# EAGLE design schema_v2_1 (EAGLE 6.2)
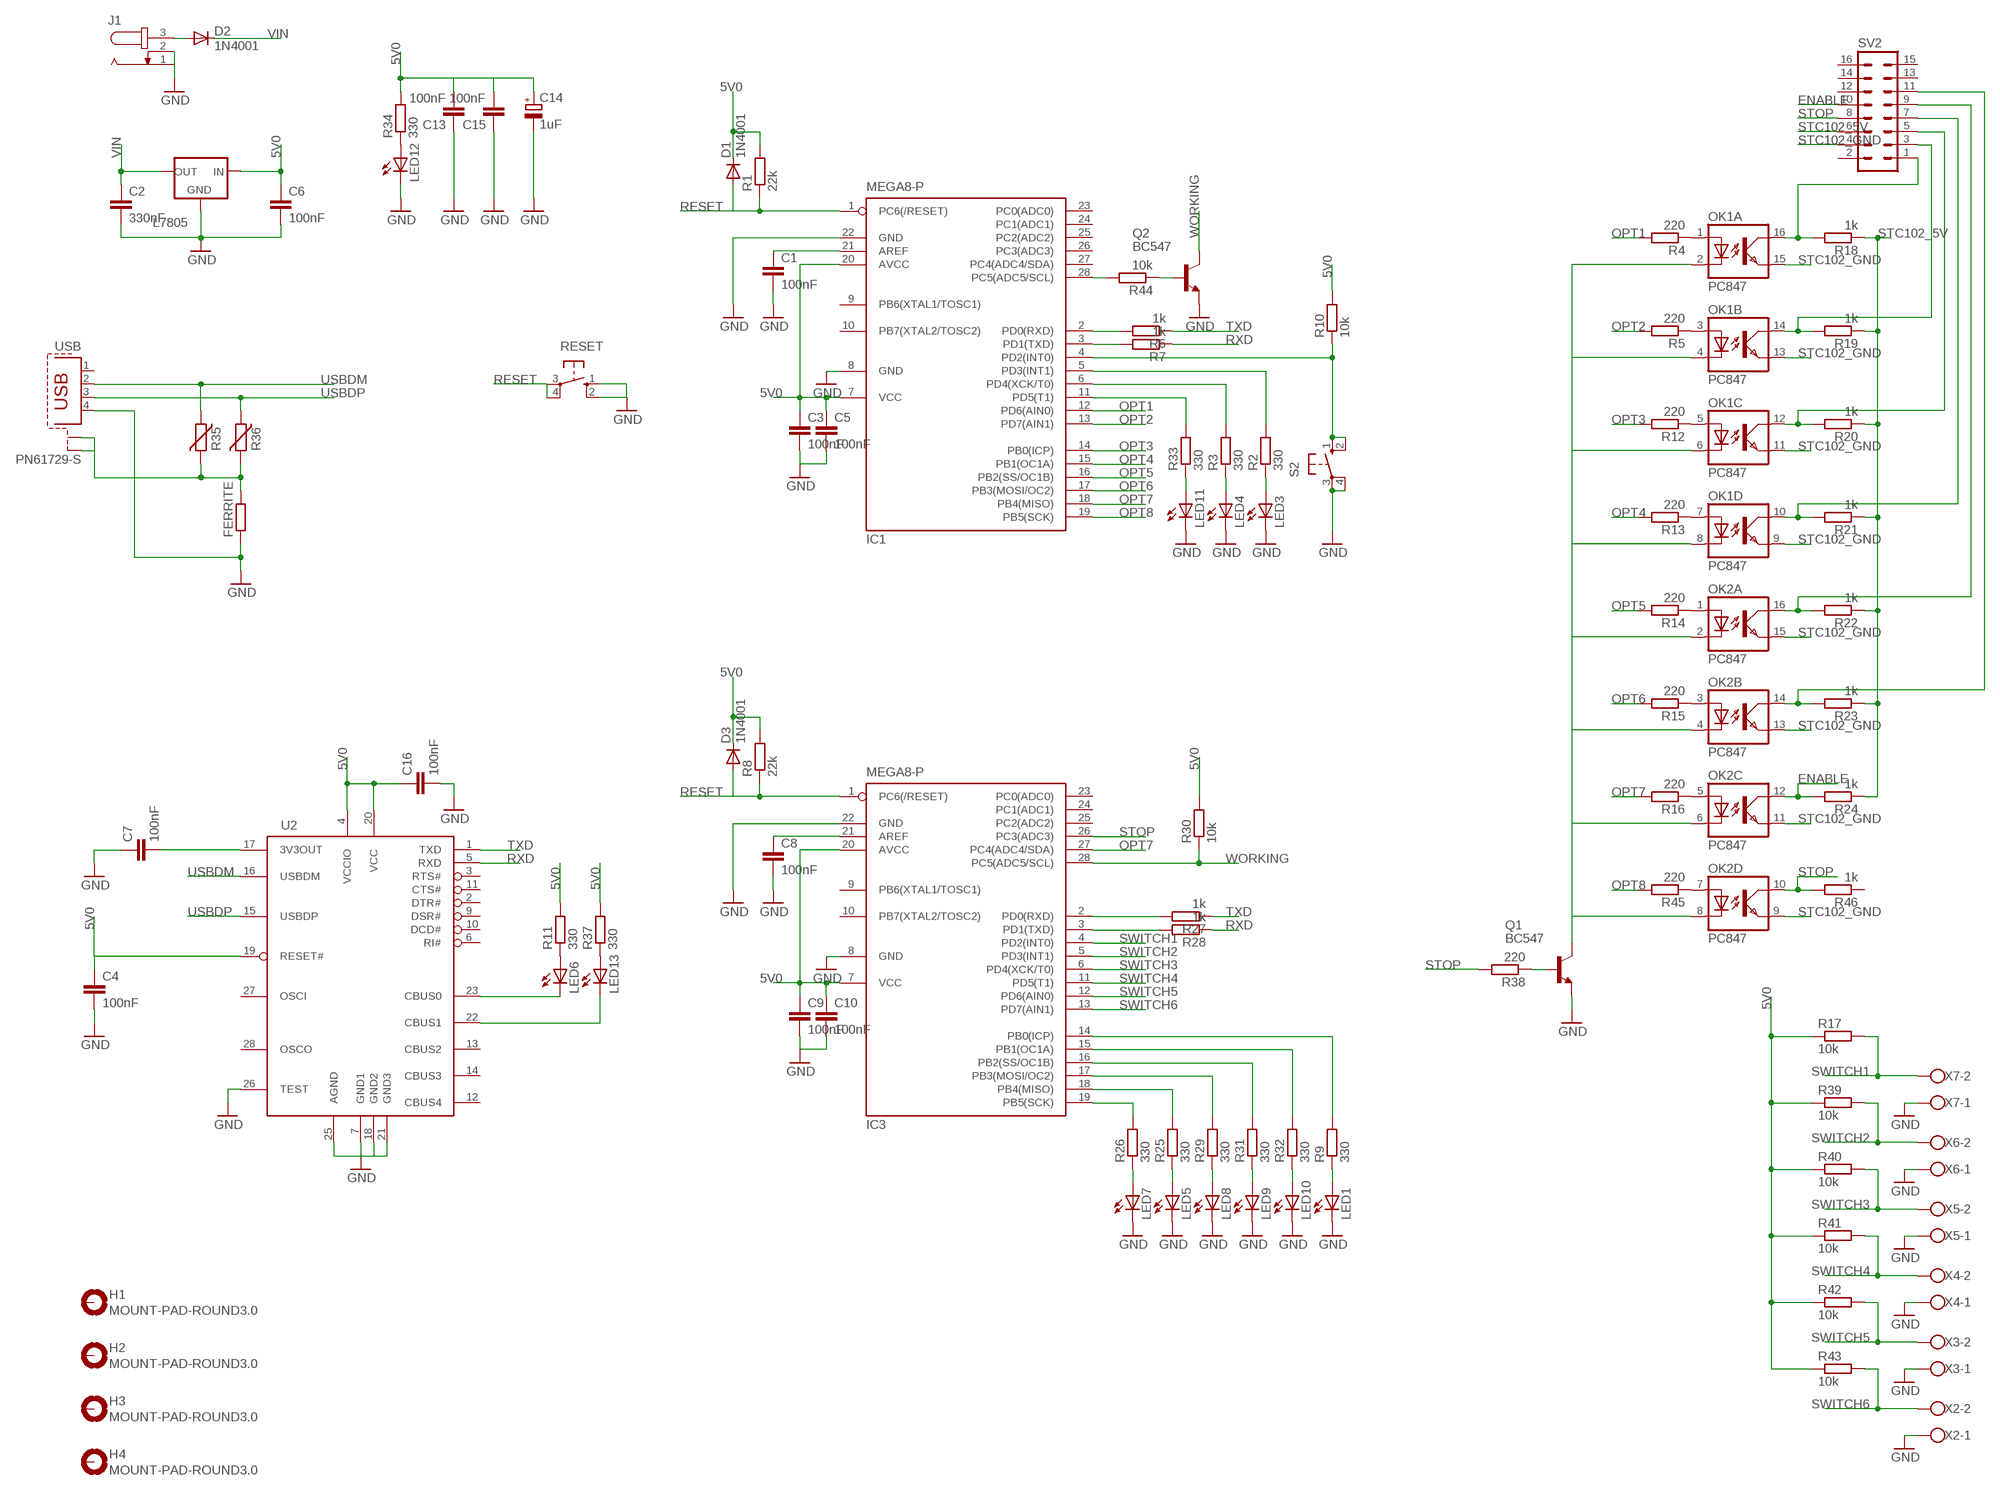
[diagram p0: schematic, sheet 1]

## Parts
C1  100nF  C-EU025-025X050  [C025-025X050]
C2  330nF  C-EU025-025X050  [C025-025X050]
C3  100nF  C-EU025-025X050  [C025-025X050]
C4  100nF  C-EUC0603K  [C0603K]
C5  100nF  C-EU025-025X050  [C025-025X050]
C6  100nF  C-EU025-025X050  [C025-025X050]
C7  100nF  C-EUC0603K  [C0603K]
C8  100nF  C-EU025-025X050  [C025-025X050]
C9  100nF  C-EU025-025X050  [C025-025X050]
C10  100nF  C-EU025-025X050  [C025-025X050]
C13  100nF  C-EU025-025X050  [C025-025X050]
C14  1uF  CPOL-EUE2.5-5  [E2,5-5]
C15  100nF  C-EU025-025X050  [C025-025X050]
C16  100nF  C-EUC0603K  [C0603K]
D1  1N4001  1N4004  [DO41-10]
D2  1N4001  1N4004  [DO41-10]
D3  1N4001  1N4004  [DO41-10]
FERRITE  R-EU_M0805  [M0805]
H1  MOUNT-PAD-ROUND3.0  [3,0-PAD]
H2  MOUNT-PAD-ROUND3.0  [3,0-PAD]
H3  MOUNT-PAD-ROUND3.0  [3,0-PAD]
H4  MOUNT-PAD-ROUND3.0  [3,0-PAD]
IC1  MEGA8-P  [DIL28-3]
IC3  MEGA8-P  [DIL28-3]
J1  JACK-PLUG0  [SPC4077]
L7805  79XXS  [79XXS]
LED1  LED3MM  [LED3MM]
LED3  LED3MM  [LED3MM]
LED4  LED3MM  [LED3MM]
LED5  LED3MM  [LED3MM]
LED6  LED3MM  [LED3MM]
LED7  LED3MM  [LED3MM]
LED8  LED3MM  [LED3MM]
LED9  LED3MM  [LED3MM]
LED10  LED3MM  [LED3MM]
LED11  LED3MM  [LED3MM]
LED12  LED3MM  [LED3MM]
LED13  LED3MM  [LED3MM]
OK1  PC847  [DIL16]
OK2  PC847  [DIL16]
Q1  BC547  [TO92]
Q2  BC547  [TO92]
R1  22k  R-EU_0207/10  [0207/10]
R2  330  R-EU_0207/10  [0207/10]
R3  330  R-EU_0207/10  [0207/10]
R4  220  R-EU_0207/10  [0207/10]
R5  220  R-EU_0207/10  [0207/10]
R6  1k  R-EU_M1206  [M1206]
R7  1k  R-EU_M1206  [M1206]
R8  22k  R-EU_0207/10  [0207/10]
R9  330  R-EU_0207/10  [0207/10]
R10  10k  R-EU_0207/10  [0207/10]
R11  330  R-EU_0207/10  [0207/10]
R12  220  R-EU_0207/10  [0207/10]
R13  220  R-EU_0207/10  [0207/10]
R14  220  R-EU_0207/10  [0207/10]
R15  220  R-EU_0207/10  [0207/10]
R16  220  R-EU_0207/10  [0207/10]
R17  10k  R-EU_R1206  [R1206]
R18  1k  R-EU_0207/10  [0207/10]
R19  1k  R-EU_0207/10  [0207/10]
R20  1k  R-EU_0207/10  [0207/10]
R21  1k  R-EU_0207/10  [0207/10]
R22  1k  R-EU_0207/10  [0207/10]
R23  1k  R-EU_0207/10  [0207/10]
R24  1k  R-EU_0207/10  [0207/10]
R25  330  R-EU_0207/10  [0207/10]
R26  330  R-EU_0207/10  [0207/10]
R27  1k  R-EU_M1206  [M1206]
R28  1k  R-EU_M1206  [M1206]
R29  330  R-EU_0207/10  [0207/10]
R30  10k  R-EU_0207/10  [0207/10]
R31  330  R-EU_0207/10  [0207/10]
R32  330  R-EU_0207/10  [0207/10]
R33  330  R-EU_0207/10  [0207/10]
R34  330  R-EU_0207/10  [0207/10]
R35  VARISTORCN0603  [CT/CN0603]
R36  VARISTORCN0603  [CT/CN0603]
R37  330  R-EU_0207/10  [0207/10]
R38  220  R-EU_0207/10  [0207/10]
R39  10k  R-EU_0207/10  [0207/10]
R40  10k  R-EU_0207/10  [0207/10]
R41  10k  R-EU_0207/10  [0207/10]
R42  10k  R-EU_0207/10  [0207/10]
R43  10k  R-EU_0207/10  [0207/10]
R44  10k  R-EU_0207/10  [0207/10]
R45  220  R-EU_0207/10  [0207/10]
R46  1k  R-EU_0207/10  [0207/10]
RESET  10-XX  [B3F-10XX]
S2  10-XX  [B3F-10XX]
SV2  MA08-2  [MA08-2]
U2  FT232RL  [SSOP28DB]
USB  PN61729-S  [PN61729-S]
X2  W237-102  [W237-102]
X3  W237-102  [W237-102]
X4  W237-102  [W237-102]
X5  W237-102  [W237-102]
X6  W237-102  [W237-102]
X7  W237-102  [W237-102]

## Nets
5V0: C3.1 C4.1 C5.1 C6.1 C9.1 C10.1 C13.2 C14.+ C15.2 C16.1 D1.C D3.C IC1.7(VCC) IC1.20(AVCC) IC3.7(VCC) IC3.20(AVCC) L7805.IN R1.2 R8.2 R10.2 R11.2 R17.1 R30.2 R34.2 R37.2 R39.1 R40.1 R41.1 R42.1 R43.1 U2.4(VCCIO) U2.19(RESET#) U2.20(VCC)
ENABLE: OK2.12(C:COL) R24.2 SV2.10
GND: C1.2 C2.2 C3.2 C4.2 C5.2 C6.2 C7.1 C8.2 C9.2 C10.2 C13.1 C14.- C15.1 C16.2 FERRITE.1 IC1.8(GND) IC1.22(GND) IC3.8(GND) IC3.22(GND) J1.1 J1.2 L7805.GND LED1.K(C) LED3.K(C) LED4.K(C) LED5.K(C) LED7.K(C) LED8.K(C) LED9.K(C) LED10.K(C) LED11.K(C) LED12.K(C) Q1.1(E) Q2.1(E) RESET.1(S) RESET.2(S1) S2.3(P) S2.4(P1) U2.7(GND1) U2.18(GND2) U2.21(GND3) U2.25(AGND) U2.26(TEST) USB.4 X2.1 X3.1 X4.1 X5.1 X6.1 X7.1
N$1: IC1.28(PC5(ADC5/SCL)) R44.2
N$2: LED1.A R9.1
N$3: C1.1 IC1.21(AREF)
N$4: IC1.6(PD4(XCK/T0)) R3.2
N$5: IC1.4(PD2(INT0)) R10.1 S2.1(S) S2.2(S1)
N$6: LED3.A R2.1
N$7: LED4.A R3.1
N$8: D2.A J1.3
N$9: OK1.16(A:COL) R18.2 SV2.1
N$10: IC1.5(PD3(INT1)) R2.2
N$11: OK1.14(B:COL) R19.2 SV2.3
N$12: OK1.12(C:COL) R20.2 SV2.5
N$13: OK1.10(D:COL) R21.2 SV2.7
N$14: OK2.16(A:COL) R22.2 SV2.9
N$15: OK2.14(B:COL) R23.2 SV2.11
N$16: C8.1 IC3.21(AREF)
N$17: LED6.K(C) U2.23(CBUS0)
N$18: LED13.K(C) U2.22(CBUS1)
N$19: LED6.A R11.1
N$20: Q2.2(B) R44.1
N$21: IC3.14(PB0(ICP)) R9.2
N$22: OK2.7(D:A) R45.1
N$23: OK1.2(A:C) OK1.4(B:C) OK1.6(C:C) OK1.8(D:C) OK2.2(A:C) OK2.4(B:C) OK2.6(C:C) OK2.8(D:C) Q1.3(C)
N$24: Q1.2(B) R38.1
N$25: IC1.2(PD0(RXD)) R6.2
N$26: IC1.3(PD1(TXD)) R7.2
N$29: OK1.1(A:A) R4.1
N$30: OK1.3(B:A) R5.1
N$31: OK1.5(C:A) R12.1
N$32: OK1.7(D:A) R13.1
N$33: OK2.1(A:A) R14.1
N$34: OK2.3(B:A) R15.1
N$35: OK2.5(C:A) R16.1
N$36: LED5.A R25.1
N$38: LED7.A R26.1
N$39: LED8.A R29.1
N$40: LED10.A R32.1
N$41: IC3.19(PB5(SCK)) R26.2
N$42: LED9.A R31.1
N$43: IC3.2(PD0(RXD)) R27.2
N$44: IC3.3(PD1(TXD)) R28.2
N$45: IC3.18(PB4(MISO)) R25.2
N$46: IC3.17(PB3(MOSI/OC2)) R29.2
N$47: IC3.16(PB2(SS/OC1B)) R31.2
N$48: IC3.15(PB1(OC1A)) R32.2
N$49: LED11.A R33.1
N$50: IC1.11(PD5(T1)) R33.2
N$51: LED12.A R34.1
N$53: FERRITE.2 R35.2 R36.2 USB.S1 USB.S2
N$55: LED13.A R37.1
N$96: C7.2 U2.17(3V3OUT)
OPT1: IC1.12(PD6(AIN0)) R4.2
OPT2: IC1.13(PD7(AIN1)) R5.2
OPT3: IC1.14(PB0(ICP)) R12.2
OPT4: IC1.15(PB1(OC1A)) R13.2
OPT5: IC1.16(PB2(SS/OC1B)) R14.2
OPT6: IC1.17(PB3(MOSI/OC2)) R15.2
OPT7: IC1.18(PB4(MISO)) IC3.27(PC4(ADC4/SDA)) R16.2
OPT8: IC1.19(PB5(SCK)) R45.2
RESET: D1.A D3.A IC1.1(PC6(/RESET)) IC3.1(PC6(/RESET)) R1.1 R8.1 RESET.3(P) RESET.4(P1)
RXD: R7.1 R28.1 U2.5(RXD)
STC102_5V: R18.1 R19.1 R20.1 R21.1 R22.1 R23.1 R24.1 SV2.6
STC102_GND: OK1.9(D:EMIT) OK1.11(C:EMIT) OK1.13(B:EMIT) OK1.15(A:EMIT) OK2.9(D:EMIT) OK2.11(C:EMIT) OK2.13(B:EMIT) OK2.15(A:EMIT) SV2.4
STOP: IC3.26(PC3(ADC3)) OK2.10(D:COL) R38.2 R46.2 SV2.8
SWITCH1: IC3.4(PD2(INT0)) R17.2 X7.2
SWITCH2: IC3.5(PD3(INT1)) R39.2 X6.2
SWITCH3: IC3.6(PD4(XCK/T0)) R40.2 X5.2
SWITCH4: IC3.11(PD5(T1)) R41.2 X4.2
SWITCH5: IC3.12(PD6(AIN0)) R42.2 X3.2
SWITCH6: IC3.13(PD7(AIN1)) R43.2 X2.2
TXD: R6.1 R27.1 U2.1(TXD)
USBDM: R35.1 U2.16(USBDM) USB.2
USBDP: R36.1 U2.15(USBDP) USB.3
VIN: C2.1 D2.C L7805.OUT
WORKING: IC3.28(PC5(ADC5/SCL)) Q2.3(C) R30.1
Unconnected: H1.B3,0(MOUNT) H2.B3,0(MOUNT) H3.B3,0(MOUNT) H4.B3,0(MOUNT) IC1.9(PB6(XTAL1/TOSC1)) IC1.10(PB7(XTAL2/TOSC2)) IC1.23(PC0(ADC0)) IC1.24(PC1(ADC1)) IC1.25(PC2(ADC2)) IC1.26(PC3(ADC3)) IC1.27(PC4(ADC4/SDA)) IC3.9(PB6(XTAL1/TOSC1)) IC3.10(PB7(XTAL2/TOSC2)) IC3.23(PC0(ADC0)) IC3.24(PC1(ADC1)) IC3.25(PC2(ADC2)) R46.1 SV2.2 SV2.12 SV2.13 SV2.14 SV2.15 SV2.16 U2.2(DTR#) U2.3(RTS#) U2.6(RI#) U2.9(DSR#) U2.10(DCD#) U2.11(CTS#) U2.12(CBUS4) U2.13(CBUS2) U2.14(CBUS3) U2.27(OSCI) U2.28(OSCO) USB.1

## Library data of the parts
C1-C10 C13 C15 C16 = rcl:C-EU: CAPACITOR, European symbol
C14 = rcl:CPOL-EU: POLARIZED CAPACITOR, European symbol
D1-D3 = diode:1N4004: DIODE general purpose rectifier, 1 A
FERRITE = resistor:R-EU_: RESISTOR, European symbol
H1-H4 = holes:MOUNT-PAD-ROUND: MOUNTING PAD, round
IC1 IC3 = atmel:MEGA8-P: MICROCONTROLLER 8 Kbytes FLASH, 1 kbytes SRAM, 512 bytes EEPROM, USART, 4-channel 10 bit ADC, 2-channel 8 bit ADC Pin compatible with Atmega48, ATMega88, ATMega168 Source: avr.lbr; OC_FARNELL: unknown; OC_NEWARK: unknown
J1 = con-jack:JACK-PLUG: DC POWER JACK Power Jack, DC, Right Angle, Through Hole, Rated 5A at 16VDC, PC Terminals Distributor: Farnell (www.Farnell.de) Drawing: 84N1161.pdf / 84N1162.pdf Manufacturer: SPC Technology (www.spctechnology.com) Type: SPC4077 / SPC 4078; OC_FARNELL: unknown; OC_NEWARK: unknown
L7805 = v-reg:79XXS: VOLTAGE REGULATOR
LED1 LED3-LED13 = led:LED: LED OSRAM: - CHIPLED LG R971, LG N971, LY N971, LG Q971, LY Q971, LO R971, LY R971 LH N974, LH R974 LS Q976, LO Q976, LY Q976 LO Q996 - Hyper CHIPLED LW Q18S LB Q993, LB Q99A, LB R99A - SideLED LS A670, LO A670, LY A670, LG A670, LP A670 LB A673, LV A673, LT A673, LW A673 LH A674 LY A675 LS A676, LA A676, LO A676, LY A676, LW A676 LS A679, LY A679, LG A679 - Hyper Micro SIDELED® LS Y876, LA Y876, LO Y876, LY Y876 LT Y87S - SmartLED LW L88C, LW L88S LB L89C, LB L89S, LG L890 LS L89K, LO L89K, LY L89K LS L896, LA L896, LO L896, LY L896 - TOPLED LS T670, LO T670, LY T670, LG T670, LP T670 LSG T670, LSP T670, LSY T670, LOP T670, LYG T670 LG T671, LOG T671, LSG T671 LB T673, LV T673, LT T673, LW T673 LH T674 LS T676, LA T676, LO T676, LY T676, LB T676, LH T676, LSB T676, LW T676 LB T67C, LV T67C, LT T67C, LS T67K, LO T67K, LY T67K, LW E67C LS E67B, LA E67B, LO E67B, LY E67B, LB E67C, LV E67C, LT E67C LW T67C LS T679, LY T679, LG T679 LS T770, LO T770, LY T770, LG T770, LP T770 LB T773, LV T773, LT T773, LW T773 LH T774 LS E675, LA E675, LY E675, LS T675 LS T776, LA T776, LO T776, LY T776, LB T776 LHGB T686 LT T68C, LB T68C - Hyper Mini TOPLED® LB M676 - Mini TOPLED Santana® LG M470 LS M47K, LO M47K, LY M47K Source: http://www.osram.convergy.de LUXEON: - LUMILED® LXK2-PW12-R00, LXK2-PW12-S00, LXK2-PW14-U00, LXK2-PW14-V00 LXK2-PM12-R00, LXK2-PM12-S00, LXK2-PM14-U00 LXK2-PE12-Q00, LXK2-PE12-R00, LXK2-PE12-S00, LXK2-PE14-T00, LXK2-PE14-U00 LXK2-PB12-K00, LXK2-PB12-L00, LXK2-PB12-M00, LXK2-PB14-N00, LXK2-PB14-P00, LXK2-PB14-Q00 LXK2-PR12-L00, LXK2-PR12-M00, LXK2-PR14-Q00, LXK2-PR14-R00 LXK2-PD12-Q00, LXK2-PD12-R00, LXK2-PD12-S00 LXK2-PH12-R00, LXK2-PH12-S00 LXK2-PL12-P00, LXK2-PL12-Q00, LXK2-PL12-R00 Source: www.luxeon.com KINGBRIGHT: KA-3528ASYC Source: www.kingbright.com
OK1 OK2 = optocoupler:PC847: SHARP OPTO COUPLER; OC_FARNELL: 9707735; OC_NEWARK: unknown
Q1 Q2 = transistor-npn:BC547*: NPN Transistor
R1-R34 R37-R46 = rcl:R-EU_: RESISTOR, European symbol
R35 R36 = varistor:VARISTOR: VARISTOR
RESET S2 = switch-omron:10-XX: OMRON SWITCH; MPN: B3F-1000; OC_FARNELL: 176432; OC_NEWARK: 36M3542
SV2 = con-lstb:MA08-2: PIN HEADER; OC_FARNELL: unknown; OC_NEWARK: unknown
U2 = ftdichip-5:FT232RL: USB UART 4th Generation USB UART (USB <-> Serial) Controller
USB = con-berg:PN61729-S: BERG USB connector; OC_FARNELL: unknown; OC_NEWARK: unknown
X2-X7 = con-wago-500:W237-102: WAGO SCREW CLAMP; MPN: 237-102; OC_FARNELL: unknown; OC_NEWARK: 70K9898

## Net classes
0 default: width 0.203 mm

## Board
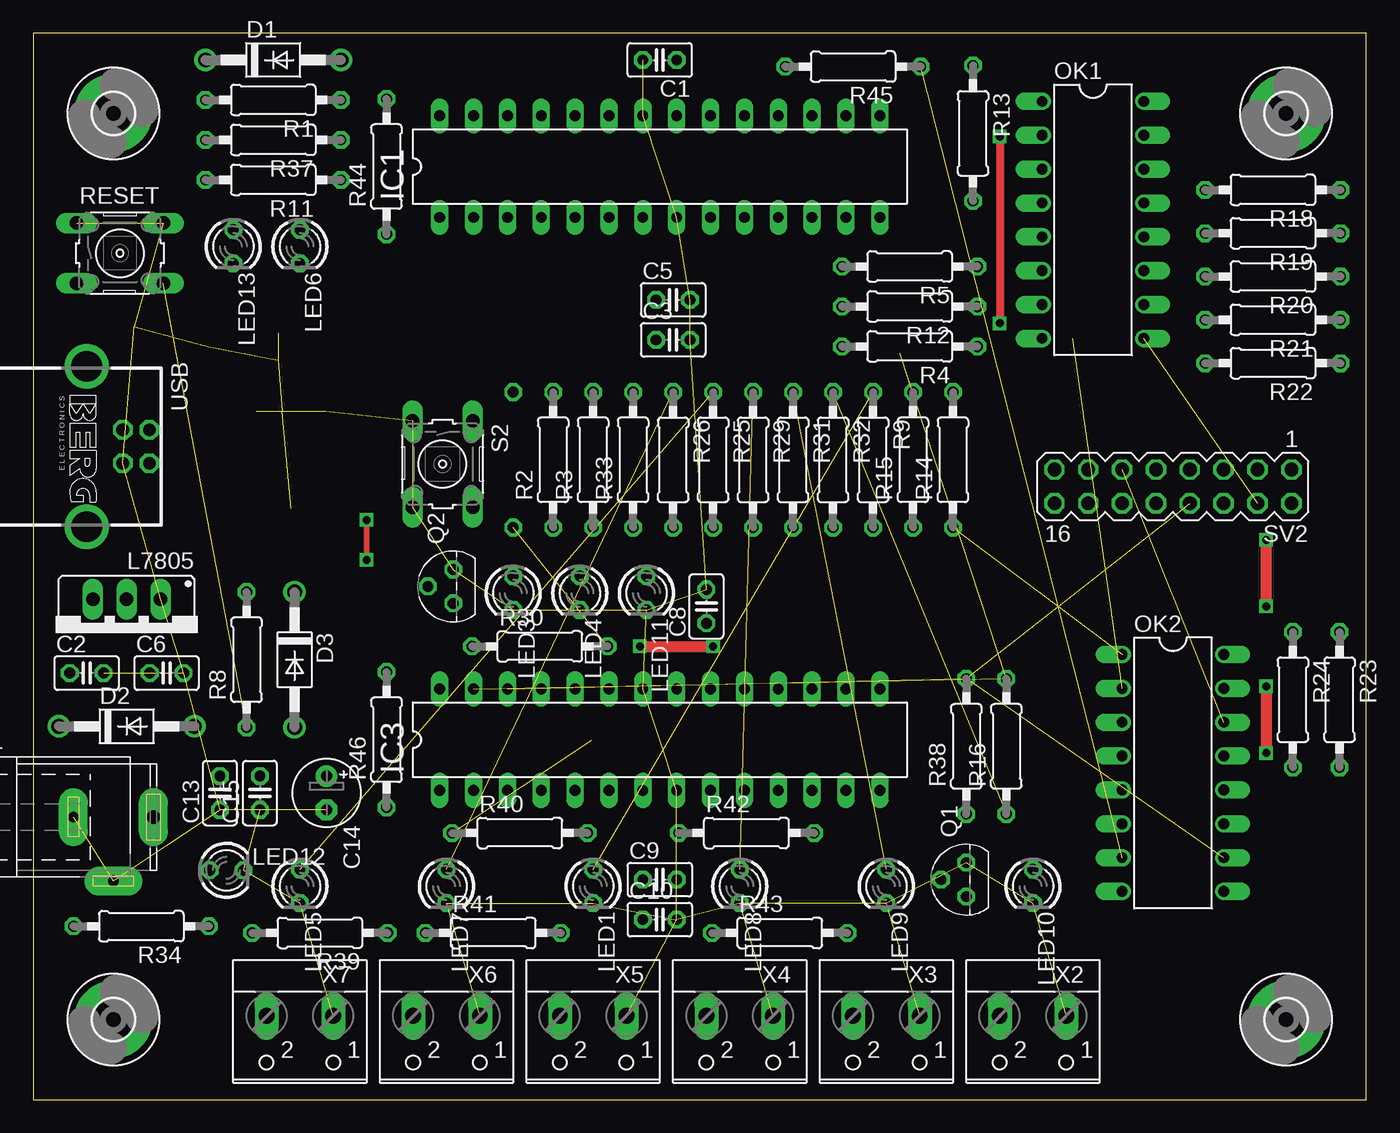
[diagram p1: board, top side]
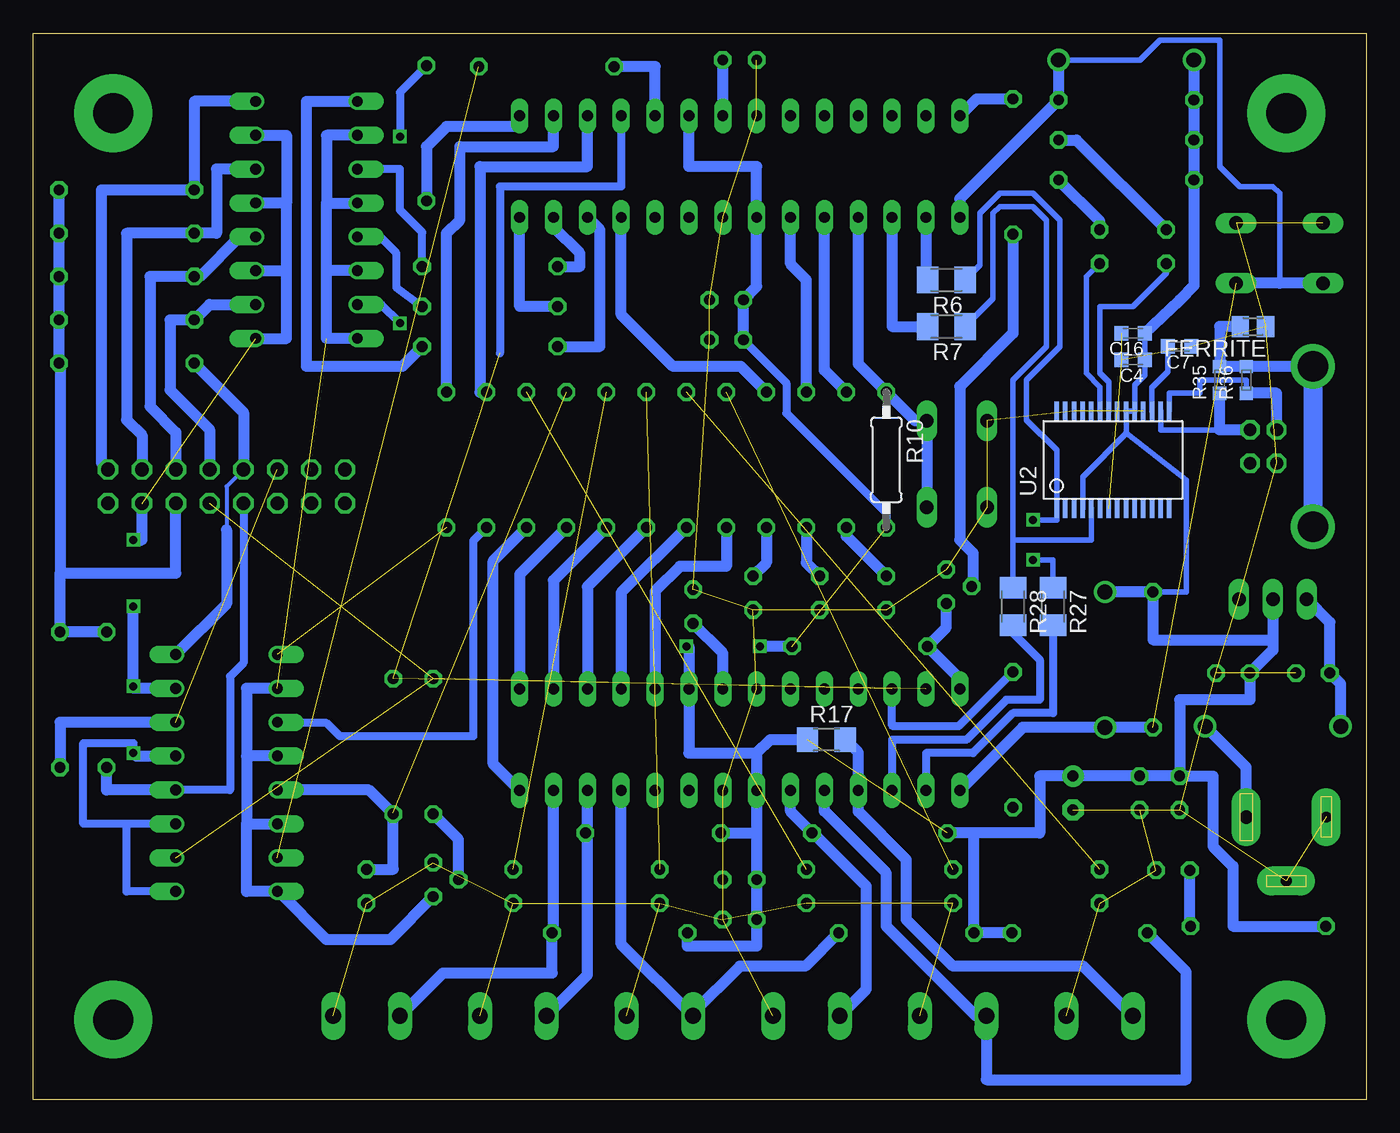
[diagram p2: board, bottom side, seen from below]

Size 100 x 80 mm. Coordinates in mm from the lower left corner, seen from the top.
Outline: 0,0 100,0 100,80 0,80 0,0
Copper layers (1*16): Top 0.035mm / dielectric 1.5mm / Bottom 0.035mm
Design rules: minimum track width 10mil, minimum drill 24mil, track to track 8mil, track to pad 8mil, pad to pad 8mil, via to via 8mil, smd to smd 8mil, copper to edge 40mil, drill to drill 8mil, minimum pad ring 10mil, minimum via ring 8mil, stop-mask expansion 4mil, vias tented up to drill 0mil, thermal gap 10mil

### Footprints (pad centres in the part's own frame; a part is rotated, then mirrored left to right if it is on the bottom)
C025-025X050 = drill 0.813 octagon: 1 -1.27,0; 2 1.27,0
C0603K = smd 1.05 x 1.08: 1 -0.875,0; 2 0.875,0
E2,5-5 = drill 0.813 pad 1.6: + -1.27,0 | drill 0.813 pad 1.6 octagon: - 1.27,0
DO41-10 = drill 1.118: A 5.08,0; C -5.08,0
M0805 = smd 1.3 x 1.6: 1 -0.95,0; 2 0.95,0
3,0-PAD = drill 3 pad 5.842: B3,0 0,0
DIL28-3 = drill 0.813 long: 1 -16.51,-3.81; 2 -13.97,-3.81; 3 -11.43,-3.81; 4 -8.89,-3.81; 5 -6.35,-3.81; 6 -3.81,-3.81; 7 -1.27,-3.81; 8 1.27,-3.81; 9 3.81,-3.81; 10 6.35,-3.81; 11 8.89,-3.81; 12 11.43,-3.81; 13 13.97,-3.81; 14 16.51,-3.81; 15 16.51,3.81; 16 13.97,3.81; 17 11.43,3.81; 18 8.89,3.81; 19 6.35,3.81; 20 3.81,3.81; 21 1.27,3.81; 22 -1.27,3.81; 23 -3.81,3.81; 24 -6.35,3.81; 25 -8.89,3.81; 26 -11.43,3.81; 27 -13.97,3.81; 28 -16.51,3.81
SPC4077 = drill 0.8 pad 2.184 long: 1 -3,0; 2 0,-4.8 | drill 1 pad 2.184 long: 3 3,0
79XXS = drill 1.016 long: GND -2.54,-2.54; IN 0,-2.54; OUT 2.54,-2.54
LED3MM = drill 0.813 octagon: A -1.27,0; K 1.27,0
DIL16 = drill 0.813 offset: 1 -8.89,-3.81; 2 -6.35,-3.81; 3 -3.81,-3.81; 4 -1.27,-3.81; 5 1.27,-3.81; 6 3.81,-3.81; 7 6.35,-3.81; 8 8.89,-3.81; 9 8.89,3.81; 10 6.35,3.81; 11 3.81,3.81; 12 1.27,3.81; 13 -1.27,3.81; 14 -3.81,3.81; 15 -6.35,3.81; 16 -8.89,3.81
TO92 = drill 0.813 octagon: 1 1.27,0; 2 0,1.905; 3 -1.27,0
0207/10 = drill 0.813 octagon: 1 -5.08,0; 2 5.08,0
M1206 = smd 1.6 x 2: 1 -1.4,0; 2 1.4,0
R1206 = smd 1.6 x 1.803: 1 -1.422,0; 2 1.422,0
CT/CN0603 = smd 1 x 1: 1 -1,0; 2 1,0
B3F-10XX = drill 1.016 long: 1 -3.251,2.261; 2 3.251,2.261; 3 -3.251,-2.261; 4 3.251,-2.261
MA08-2 = drill 1.016 octagon: 1 -8.89,-1.27; 2 -8.89,1.27; 3 -6.35,-1.27; 4 -6.35,1.27; 5 -3.81,-1.27; 6 -3.81,1.27; 7 -1.27,-1.27; 8 -1.27,1.27; 9 1.27,-1.27; 10 1.27,1.27; 11 3.81,-1.27; 12 3.81,1.27; 13 6.35,-1.27; 14 6.35,1.27; 15 8.89,-1.27; 16 8.89,1.27
SSOP28DB = smd 0.348 x 1.397: 1 -4.225,-3.656; 2 -3.575,-3.656; 3 -2.925,-3.656; 4 -2.275,-3.656; 5 -1.625,-3.656; 6 -0.975,-3.656; 7 -0.325,-3.656; 8 0.325,-3.656; 9 0.975,-3.656; 10 1.625,-3.656; 11 2.275,-3.656; 12 2.925,-3.656; 13 3.575,-3.656; 14 4.225,-3.656; 15 4.225,3.656; 16 3.575,3.656; 17 2.925,3.656; 18 2.275,3.656; 19 1.625,3.656; 20 0.975,3.656; 21 0.325,3.656; 22 -0.325,3.656; 23 -0.975,3.656; 24 -1.625,3.656; 25 -2.275,3.656; 26 -2.925,3.656; 27 -3.575,3.656; 28 -4.225,3.656
PN61729-S = drill 0.95 octagon: 1 1.25,4.71; 2 -1.25,4.71; 3 -1.25,2.71; 4 1.25,2.71 | drill 2.3 pad 2.9: S1 -6.02,0; S2 6.02,0
W237-102 = drill 1.194 long: 1 -2.5,-1.27; 2 2.5,-1.27

### Placement (x,y rotation side)
C1  47,78 180 top
C2  4,32 0 top
C3  48,57 0 top
C4  17.5,55.5 180 bottom
C5  48,60 0 top
C6  10,32 0 top
C7  14,56.5 180 bottom
C8  50.5,37 90 top
C9  47,16.5 0 top
C10  47,13.5 0 top
C13  14,23 90 top
C14  22,23 270 top
C15  17,23 90 top
C16  17.5,57.5 180 bottom
D1  18,78 0 top
D2  7,28 0 top
D3  19.6,33 270 top
FERRITE  8.5,58 180 bottom
H1  94,74 0 top
H2  6,74 0 top
H3  6,6 0 top
H4  94,6 0 top
IC1  47,70 0 top
IC3  47,27 0 top
J1  6,21.2 0 top
L7805  7,35 180 top
LED1  42,16 270 top
LED3  36,38 270 top
LED4  41,38 270 top
LED5  20,16 270 top
LED6  20,64 270 top
LED7  31,16 270 top
LED8  53,16 270 top
LED9  64,16 270 top
LED10  75,16 270 top
LED11  46,38 270 top
LED12  14.5,17.2 0 top
LED13  15,64 270 top
OK1  79.5,66 270 top
OK2  85.5,24.5 270 top
Q1  70,16.5 90 top
Q2  31.5,38.5 90 top
R1  18,75 180 top
R2  39,48 90 top
R3  42,48 90 top
R4  65.75,56.5 180 top
R5  65.75,62.5 180 top
R6  31.5,61.5 180 bottom
R7  31.5,58 180 bottom
R8  16,33 90 top
R9  63,48 270 top
R10  36,48 270 bottom
R11  18,69 180 top
R12  65.75,59.5 180 top
R13  70.5,72.5 270 top
R14  69,48 90 top
R15  66,48 90 top
R16  73,26.5 90 top
R17  40.5,27 0 bottom
R18  93,68.25 180 top
R19  93,65 180 top
R20  93,61.75 180 top
R21  93,58.5 180 top
R22  93,55.25 180 top
R23  98,30 270 top
R24  94.5,30 270 top
R25  51,48 270 top
R26  48,48 270 top
R27  23.5,37 270 bottom
R28  26.5,37 270 bottom
R29  54,48 270 top
R30  38,34 0 top
R31  57,48 270 top
R32  60,48 270 top
R33  45,48 90 top
R34  8.1,13 180 top
R35  11,54 90 bottom
R36  9,54 90 bottom
R37  18,72 180 top
R38  70,26.5 90 top
R39  21.5,12.5 180 top
R40  36.5,20 0 top
R41  34.5,12.5 0 top
R42  53.5,20 0 top
R43  56,12.5 0 top
R44  26.5,70 90 top
R45  61.5,77.5 180 top
R46  26.5,27 90 top
RESET  6.5,63.5 0 top
S2  30.7,47.68 270 top
SV2  85.5,46 180 top
U2  19,48 0 bottom
USB  4,49 270 top
X2  75,5 180 top
X3  64,5 180 top
X4  53,5 180 top
X5  42,5 180 top
X6  31,5 180 top
X7  20,5 180 top

### Tracks (layer width: path | path; a pad name or v marks a point on that pad's centre or on a via)
5V0  (via drill 0.6)  (2 unrouted)
  Top 0.813: v45.5,34 v51,34
  Bottom 0.406: C16.1 C4.1 16.62,54.38 17.38,53.62 U2.19 U2.20 18,51.66 18,50 | 18,50 21.27,46.73 U2.4 | D3.C 13.5,38.08 13.5,46.5 18,50
  Bottom 0.61: C3.1 43.5,53.77 43.5,51.5 36,44 R10.2
  Bottom 0.813: C13.2 C15.2 C14.+ 24.5,24.27 24.5,20 29.42,20 | C13.2 11.5,24.27 11.5,19 10,17.5 10,13 R34.2 | L7805.IN 7,34.5 | 7,34.5 7,33.73 C6.1 8.73,30 14,30 C13.2 | 7,34.5 16,34.5 R8.2 D3.C | 45.73,20 IC3.7 45.73,26 | 45.73,20 C9.1 C10.1 45.73,11.5 50.92,11.5 R43.1 | D1.C R1.2 R37.2 R11.2 12.92,61.08 14,60 C16.1 | C3.1 C5.1 45.73,61 IC1.7 45.73,70 50.81,70 IC1.20 | R39.1 R41.1 29.42,20 | 29.42,20 R40.1 | R42.1 45.73,20 | 45.73,26 50.81,26 IC3.20 50.81,34 v51,34 | R30.2 v45.5,34 | R17.1 44.73,27 45.73,26
ENABLE
  Bottom 0.61: SV2.10 84.23,32.77 85.25,31.75 85.25,23.23 OK2.12
  Bottom 0.813: OK2.12 94.5,23.23 R24.2
GND  (49 unrouted)
N$1
  Bottom 0.813: IC1.28 29.22,75.08 R44.2
N$2  (1 unrouted)
N$3
  Bottom 0.813: IC1.21 C1.1
N$4
  Bottom 0.813: R3.2 42,61.5 43.19,62.69 IC1.6
N$5
  Bottom 0.813: IC1.4 38.11,55.19 R10.1 33.85,50.93 S2.1 S2.2
N$6
  Bottom 0.813: R2.1 39,42.27 LED3.A
N$7
  Bottom 0.813: R3.1 42,40.27 LED4.A
N$8
  Bottom 0.813: J1.3 9,24.92 D2.A
N$9
  Bottom 0.813: OK1.16 87.92,74.89 R18.2 94.89,68.25 94.89,47.77 SV2.1
N$10
  Bottom 0.813: R2.2 40.65,54.73 IC1.5
N$11
  Bottom 0.813: OK1.14 86.25,69.81 86.25,65 R19.2 93,65 93,51 91.85,49.85 SV2.3
N$12
  Bottom 0.813: OK1.12 84.52,64.73 87.5,61.75 R20.2 91.25,61.75 91.25,52 89.31,50.06 SV2.5
N$13
  Bottom 0.813: OK1.10 86.77,59.65 R21.2 89.75,58.5 89.75,53.25 86.77,50.27 SV2.7
N$14
  Bottom 0.305: SV2.9 85.5,46 85.5,42.75
  Bottom 0.813: R22.2 84.23,51.56 SV2.9 | 85.5,42.75 85.5,37.2 OK2.16
N$15  (1 unrouted)
  Bottom 0.813: OK2.14 98,28.31 R23.2
N$16
  Bottom 0.813: IC3.21 48.27,33.5 C8.1
N$17
  Bottom 0.406: U2.23 19.98,53.48 21,54.5 21,61.73 LED6.K
N$18
  Bottom 0.406: U2.22 19.32,53.83 20,54.5 20,59.5 17.5,59.5 15,62 LED13.K
N$19
  Bottom 0.813: LED6.A 20,65.92 R11.1
N$20
  Bottom 0.813: R44.1 26.5,57.5 30.5,53.5 30.5,42 29.5,41 29.5,38.59 Q2.2
N$21
  Bottom 0.813: IC3.14 65.5,25.18 65.5,40.42 R9.2
N$22  (1 unrouted)
N$23  (1 unrouted)
  Bottom 0.813: Q1.3 73.23,12 78,12 81.61,15.61 OK2.8 84,15.61 84,20.69 | 84,20.69 OK2.6 | OK2.4 84,25.77 | 84,25.77 84,20.69 | OK2.2 84,30.85 84,25.77 | OK1.2 78,72.35 78,67.27 | 78,67.27 OK1.4 | OK1.6 78,62.19 | 78,62.19 78,67.27 | OK1.8 78,57.11 78,62.19
N$24
  Bottom 0.813: Q1.2 68.09,19.52 R38.1
N$25
  Bottom 0.813: IC1.2 33.03,61.5 R6.2
N$26
  Bottom 0.813: IC1.3 35.57,58 R7.2
N$29
  Bottom 0.813: R4.1 72.33,55 79.5,55 79.5,74.89 OK1.1
N$30
  Bottom 0.61: R5.1 70.83,65.08 72.5,66.75 72.5,69.81 OK1.3
N$31
  Bottom 0.61: R12.1 72.75,60.92 72.75,63.5 73.98,64.73 OK1.5
N$32  (via drill 0.6)
  Top 0.61: v72.5,72.25 v72.5,58.25
  Bottom 0.61: R13.1 72.5,75.58 v72.5,72.25 | v72.5,58.25 73.9,59.65 OK1.7
N$33  (1 unrouted)
N$34
  Bottom 0.61: R15.1 67,41.92 67,27.25 77,27.25 78,28.25 81.63,28.25 OK2.3
N$35
  Bottom 0.813: R16.1 74.81,23.23 OK2.5
N$36  (1 unrouted)
N$38  (1 unrouted)
N$39  (1 unrouted)
N$40  (1 unrouted)
  Bottom 0.813: LED10.A 73,17.27 73,21.5
N$41
  Bottom 0.813: R26.2 48,40 51.5,40 53.35,38.15 IC3.19
N$42  (1 unrouted)
N$43
  Bottom 0.61: R27.2 23.5,29 26.5,29 29.5,26 33.03,26 IC3.2
N$44
  Bottom 0.61: R28.2 26.5,35 24.5,33 24.5,30 27,30 30,27 35.57,27 IC3.3
N$45
  Bottom 0.813: R25.2 55.89,38.03 IC3.18
N$46
  Bottom 0.813: R29.2 58.43,38.49 IC3.17
N$47
  Bottom 0.813: R31.2 60.97,38.95 IC3.16
N$48
  Bottom 0.813: R32.2 63.51,39.41 IC3.15
N$49
  Bottom 0.813: R33.1 45,40.27 LED11.A
N$50
  Bottom 0.813: R33.2 46.92,55 52,55 55.89,58.89 IC1.11
N$51
  Bottom 0.813: R34.1 arc90 13.23,13.05 LED12.A
N$53
  Bottom 0.813: FERRITE.2 11,58 R35.2 R36.2 4.02,55 USB.S1
  Bottom 1.422: USB.S1 USB.S2
N$55
  Bottom 0.813: R37.1 21.73,72 LED13.A
N$96
  Bottom 0.406: U2.17 16.07,53.42 14.88,54.62 C7.2
OPT1
  Bottom 0.813: R4.2 57.5,56.5 57.5,65.26 IC1.12
OPT2
  Bottom 0.813: R5.2 59,62.5 59,63.5 61,65.5 61,66.16 IC1.13
OPT3
  Bottom 0.813: R12.2 63.51,59.5 IC1.14
OPT4
  Bottom 0.813: IC1.15 63.51,73 69,73 70.5,71.5 R13.2
OPT5
  Bottom 0.813: R14.2 69,65 68,66 68,71.5 60.97,71.5 IC1.16
OPT6
  Bottom 0.813: IC1.17 58.43,70 66.5,70 66.5,53.08 R15.2
OPT7  (2 unrouted)
  Bottom 0.61: IC1.18 55.89,68.5 65,68.5 65,56
OPT8
  Bottom 0.813: IC1.19 53.35,77.5 R45.2
RESET  (1 unrouted)
  Bottom 0.406: 6.5,61.24 6.5,68 7,68.5 9.5,68.5 11,70 11,79.5 15.5,79.5 17,78 D1.A
  Bottom 0.813: R8.1 D3.A 25.76,27.92 IC3.1 | D1.A R1.1 30.49,67.59 IC1.1 | RESET.3 6.5,61.24 RESET.4
RXD
  Bottom 0.406: R7.1 28,60.1 28,66.5 27.5,67 25,67 24,66 24,56.5 26.5,54 R28.1 26.5,42 20.62,42 U2.5
STC102_5V
  Bottom 0.813: 98,39.5 98,55 R22.1 R21.1 R20.1 R19.1 R18.1 | 98,39.5 89.31,39.5 SV2.6 | R24.1 R23.1 98,39.5
STC102_GND  (via drill 0.6)  (1 unrouted)
  Top 0.813: v92.5,37 v92.5,42 | v92.5,31 v92.5,26
  Bottom 0.61: OK2.11 93,20.69 | 93,20.69 96.25,20.69 96.25,26.75 92.5,26.75 v92.5,26 | OK2.9 93,15.61 93,20.69
  Bottom 0.813: OK1.15 81,72.35 81,67.27 | 81,67.27 OK1.13 | OK1.11 81,62.19 | 81,62.19 81,67.27 | OK1.9 81,57.11 81,62.19 | v92.5,37 v92.5,31 92.5,30.85 OK2.15 | v92.5,42 91.85,42 SV2.4 | v92.5,26 92.27,25.77 OK2.13
STOP  (3 unrouted)
  Bottom 0.61: R46.2 30.58,28 35.5,28 35.57,28.07 IC3.26
SWITCH1
  Bottom 0.813: X7.2 21.23,10 31,10 34.5,13.5 34.5,18 38.11,21.61 IC3.4 38.11,26.03 R17.2
SWITCH2
  Bottom 0.813: IC3.5 40.65,21.65 36,17 36,13 29.27,6.27 X6.2 28.5,1.5 13.5,1.5 13.5,9.58 R39.2
SWITCH3
  Bottom 0.813: X5.2 37.5,8.27 37.5,16 41.5,20 R40.2 43.19,21.61 IC3.6
SWITCH4
  Bottom 0.813: IC3.11 55.89,11.66 X4.2 50.5,6.5 47,10 42.08,10 R41.2
SWITCH5
  Bottom 0.813: X3.2 58.43,9.34 58.43,19.85 R42.2 58.43,20.15 IC3.12
SWITCH6
  Bottom 0.813: X2.2 69.27,9.5 61.08,9.5 R43.2 60.97,12.61 IC3.13
TXD  (via drill 0.6)
  Top 0.406: v25,40.5 v25,43.5
  Bottom 0.406: R6.1 29,62.6 29,66.5 27.5,68 25,68 23,66 23,56.5 25.5,54 25.5,51 23.23,48.73 U2.1 23.23,43.5 v25,43.5 | R27.1 23.5,40.5 v25,40.5
USBDM
  Bottom 0.406: U2.16 15.43,50.25 11,50.25
  Bottom 0.813: USB.2 11,50.25 R35.1
USBDP
  Bottom 0.406: U2.15 14.78,53 12.5,53 12.5,54 9,54 R36.1
  Bottom 0.813: USB.3 6.71,53 R36.1
VIN
  Bottom 0.813: D2.C 1.92,31.19 C2.1 2.73,35.81 L7805.OUT
WORKING
  Bottom 0.813: IC3.28 30.49,31.57 R30.1 31.5,35.42 Q2.3